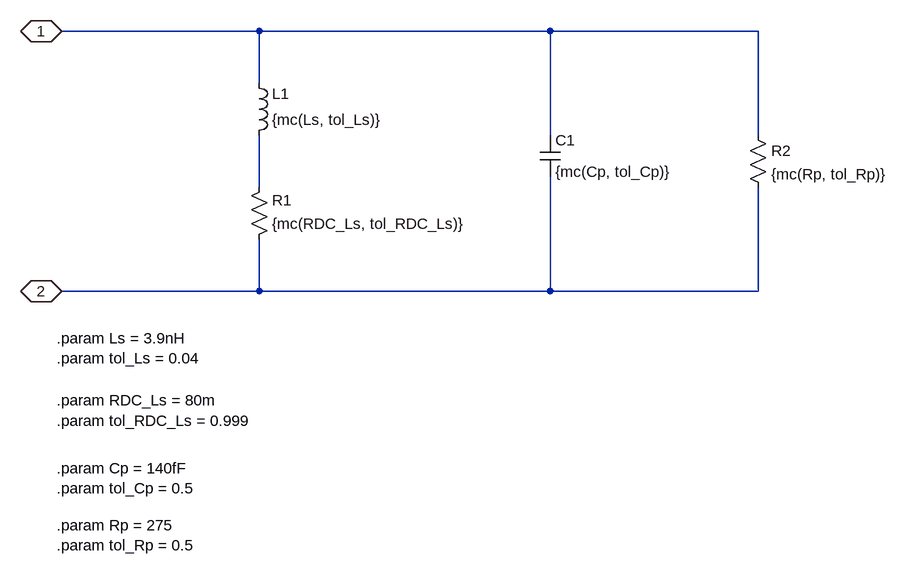
[diagram p0: schematic LQP03HQ3N9B02D.asc]
LQP03HQ3N9B02D.asc, the LTspice schematic file:
Version 4
SHEET 1 1332 1072
WIRE 336 48 32 48
WIRE 784 48 336 48
WIRE 1104 48 784 48
WIRE 336 128 336 48
WIRE 784 208 784 48
WIRE 1104 208 1104 48
WIRE 336 288 336 208
WIRE 336 448 336 368
WIRE 336 448 32 448
WIRE 784 448 784 272
WIRE 784 448 336 448
WIRE 1104 448 1104 288
WIRE 1104 448 784 448
FLAG 32 448 2
IOPIN 32 448 BiDir
FLAG 32 48 1
IOPIN 32 48 BiDir
SYMBOL ind 320 224 M180
WINDOW 0 36 80 Left 2
WINDOW 3 36 40 Left 2
SYMATTR InstName L1
SYMATTR Value {mc(Ls, tol_Ls)}
SYMBOL res 320 384 M180
WINDOW 0 36 76 Left 2
WINDOW 3 36 40 Left 2
SYMATTR InstName R1
SYMATTR Value {mc(RDC_Ls, tol_RDC_Ls)}
SYMBOL cap 768 208 R0
SYMATTR InstName C1
SYMATTR Value {mc(Cp, tol_Cp)}
SYMBOL res 1088 192 R0
SYMATTR InstName R2
SYMATTR Value {mc(Rp, tol_Rp)}
TEXT 24 520 Left 2 !.param Ls = 3.9nH\n.param tol_Ls = 0.04
TEXT 24 616 Left 2 !.param RDC_Ls = 80m\n.param tol_RDC_Ls = 0.999
TEXT 24 720 Left 2 !.param Cp = 140fF\n.param tol_Cp = 0.5
TEXT 24 808 Left 2 !.param Rp = 275\n.param tol_Rp = 0.5

The netlist it stands for:
* LQP03HQ3N9B02D.asc
L1 N001 1 {mc(Ls, tol_Ls)}
R1 2 N001 {mc(RDC_Ls, tol_RDC_Ls)}
C1 1 2 {mc(Cp, tol_Cp)}
R2 1 2 {mc(Rp, tol_Rp)}
.param Ls = 3.9nH
.param tol_Ls = 0.04
.param RDC_Ls = 80m
.param tol_RDC_Ls = 0.999
.param Cp = 140fF
.param tol_Cp = 0.5
.param Rp = 275
.param tol_Rp = 0.5
.backanno
.end